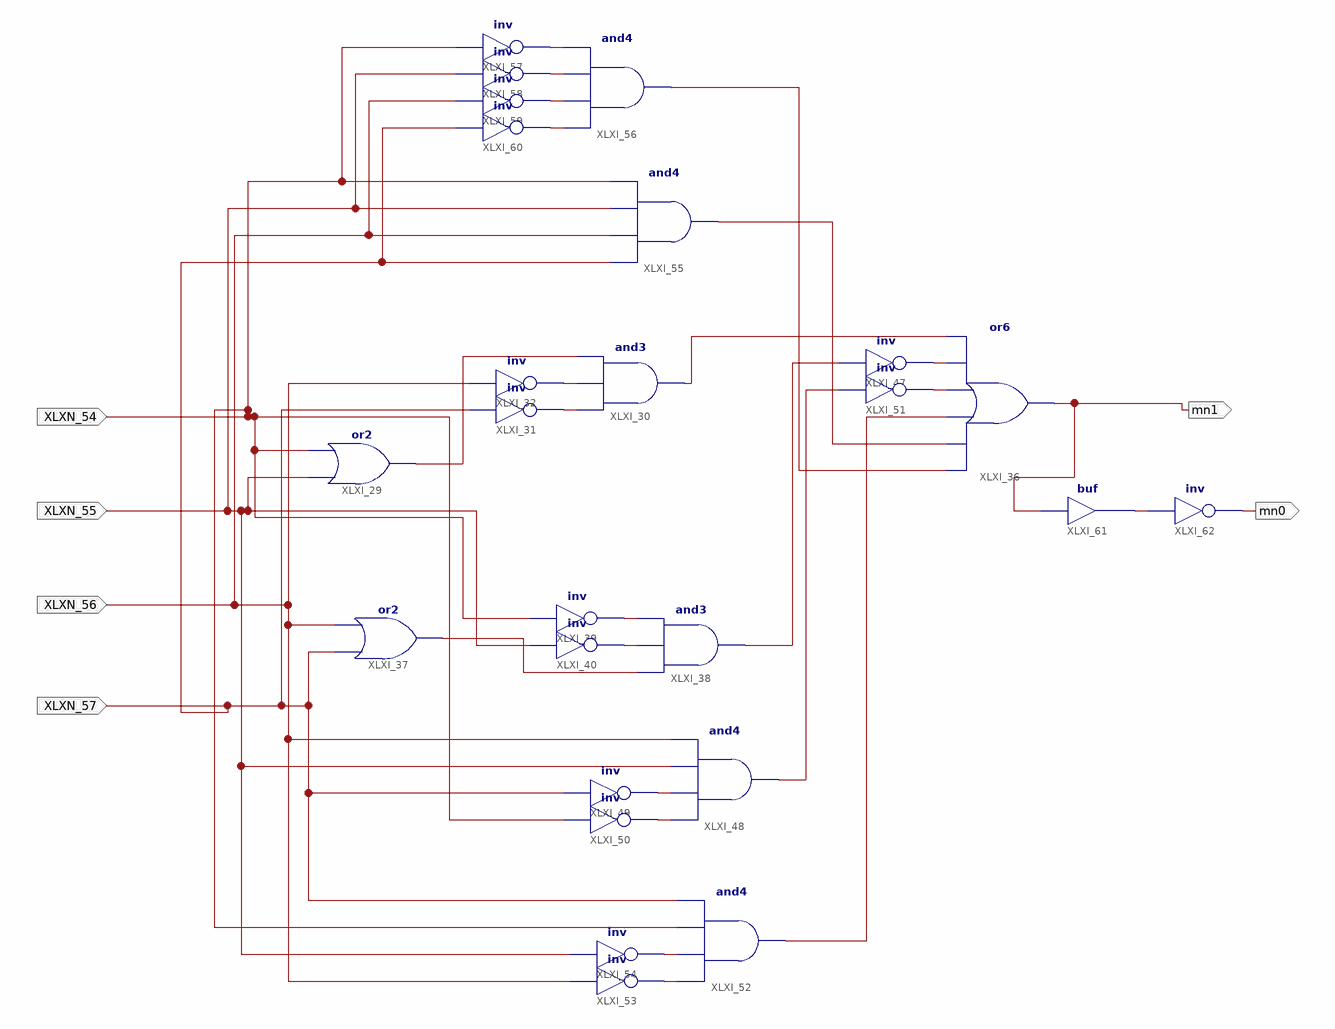
[diagram p0: schematic sheet 1]
// Xilinx ISE schematic xxxxx.sch (spartan6) as structural Verilog: 25 symbols, 6 ports
module xxxxx (
  input  XLXN_54,
  input  XLXN_55,
  input  XLXN_56,
  input  XLXN_57,
  output mn1,
  output mn0
);

  wire XLXN_62, XLXN_63, XLXN_66, XLXN_69, XLXN_73, XLXN_74, XLXN_79, XLXN_81, XLXN_82, XLXN_85, XLXN_86,
       XLXN_88, XLXN_89, XLXN_90, XLXN_91, XLXN_95, XLXN_99, XLXN_100, XLXN_101, XLXN_102, XLXN_103,
       XLXN_108, XLXN_109;

  or XLXI_29 (XLXN_66, XLXN_55, XLXN_54);
  and XLXI_30 (XLXN_69, XLXN_62, XLXN_63, XLXN_66);
  not XLXI_31 (XLXN_62, XLXN_57);
  not XLXI_32 (XLXN_63, XLXN_56);
  or XLXI_37 (XLXN_79, XLXN_57, XLXN_56);
  and XLXI_38 (XLXN_82, XLXN_79, XLXN_74, XLXN_73);
  not XLXI_39 (XLXN_73, XLXN_54);
  not XLXI_40 (XLXN_74, XLXN_55);
  or XLXI_36 (mn1, XLXN_108, XLXN_99, XLXN_95, XLXN_88, XLXN_81, XLXN_69);
  not XLXI_47 (XLXN_81, XLXN_82);
  and XLXI_48 (XLXN_89, XLXN_86, XLXN_85, XLXN_55, XLXN_56);
  not XLXI_49 (XLXN_85, XLXN_57);
  not XLXI_50 (XLXN_86, XLXN_54);
  not XLXI_51 (XLXN_88, XLXN_89);
  and XLXI_52 (XLXN_95, XLXN_91, XLXN_90, XLXN_54, XLXN_57);
  not XLXI_53 (XLXN_91, XLXN_56);
  not XLXI_54 (XLXN_90, XLXN_55);
  and XLXI_55 (XLXN_99, XLXN_57, XLXN_56, XLXN_55, XLXN_54);
  and XLXI_56 (XLXN_108, XLXN_103, XLXN_102, XLXN_101, XLXN_100);
  not XLXI_57 (XLXN_100, XLXN_54);
  not XLXI_58 (XLXN_101, XLXN_55);
  not XLXI_59 (XLXN_102, XLXN_56);
  not XLXI_60 (XLXN_103, XLXN_57);
  buf XLXI_61 (XLXN_109, mn1);
  not XLXI_62 (mn0, XLXN_109);
endmodule
